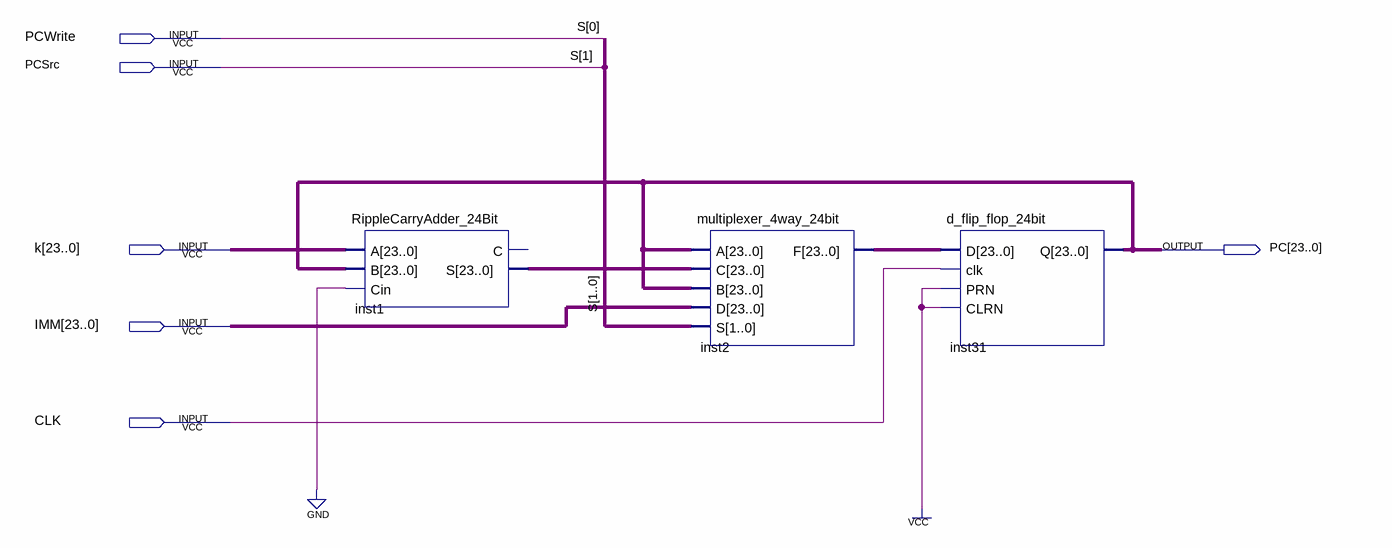
[diagram p0: schematic sheet]
// Quartus schematic program_counter_24bit.bdf as structural Verilog: 3 symbols, 6 pins
module program_counter_24bit (
  input  PCWrite,
  input  PCSrc,
  input  [23:0] k,
  input  [23:0] IMM,
  input  CLK,
  output [23:0] PC
);

  wire [23:0] inst1_s, inst2_f;

  RippleCarryAdder_24Bit inst1 (.A(k), .B(PC), .Cin(1'b0), .S(inst1_s));  // open: C
  multiplexer_4way_24bit inst2 (.A(PC), .C(inst1_s), .B(PC), .D(IMM), .S({PCSrc, PCWrite}), .F(inst2_f));
  d_flip_flop_24bit inst31 (.D(inst2_f), .clk(CLK), .PRN(1'b1), .CLRN(1'b1), .Q(PC));

  // Other names for the same wires on the sheet: S[1:0] = {PCSrc, PCWrite}
endmodule
